# Altium schematic sheet [08] - Microcontroller.SchDoc
size A3
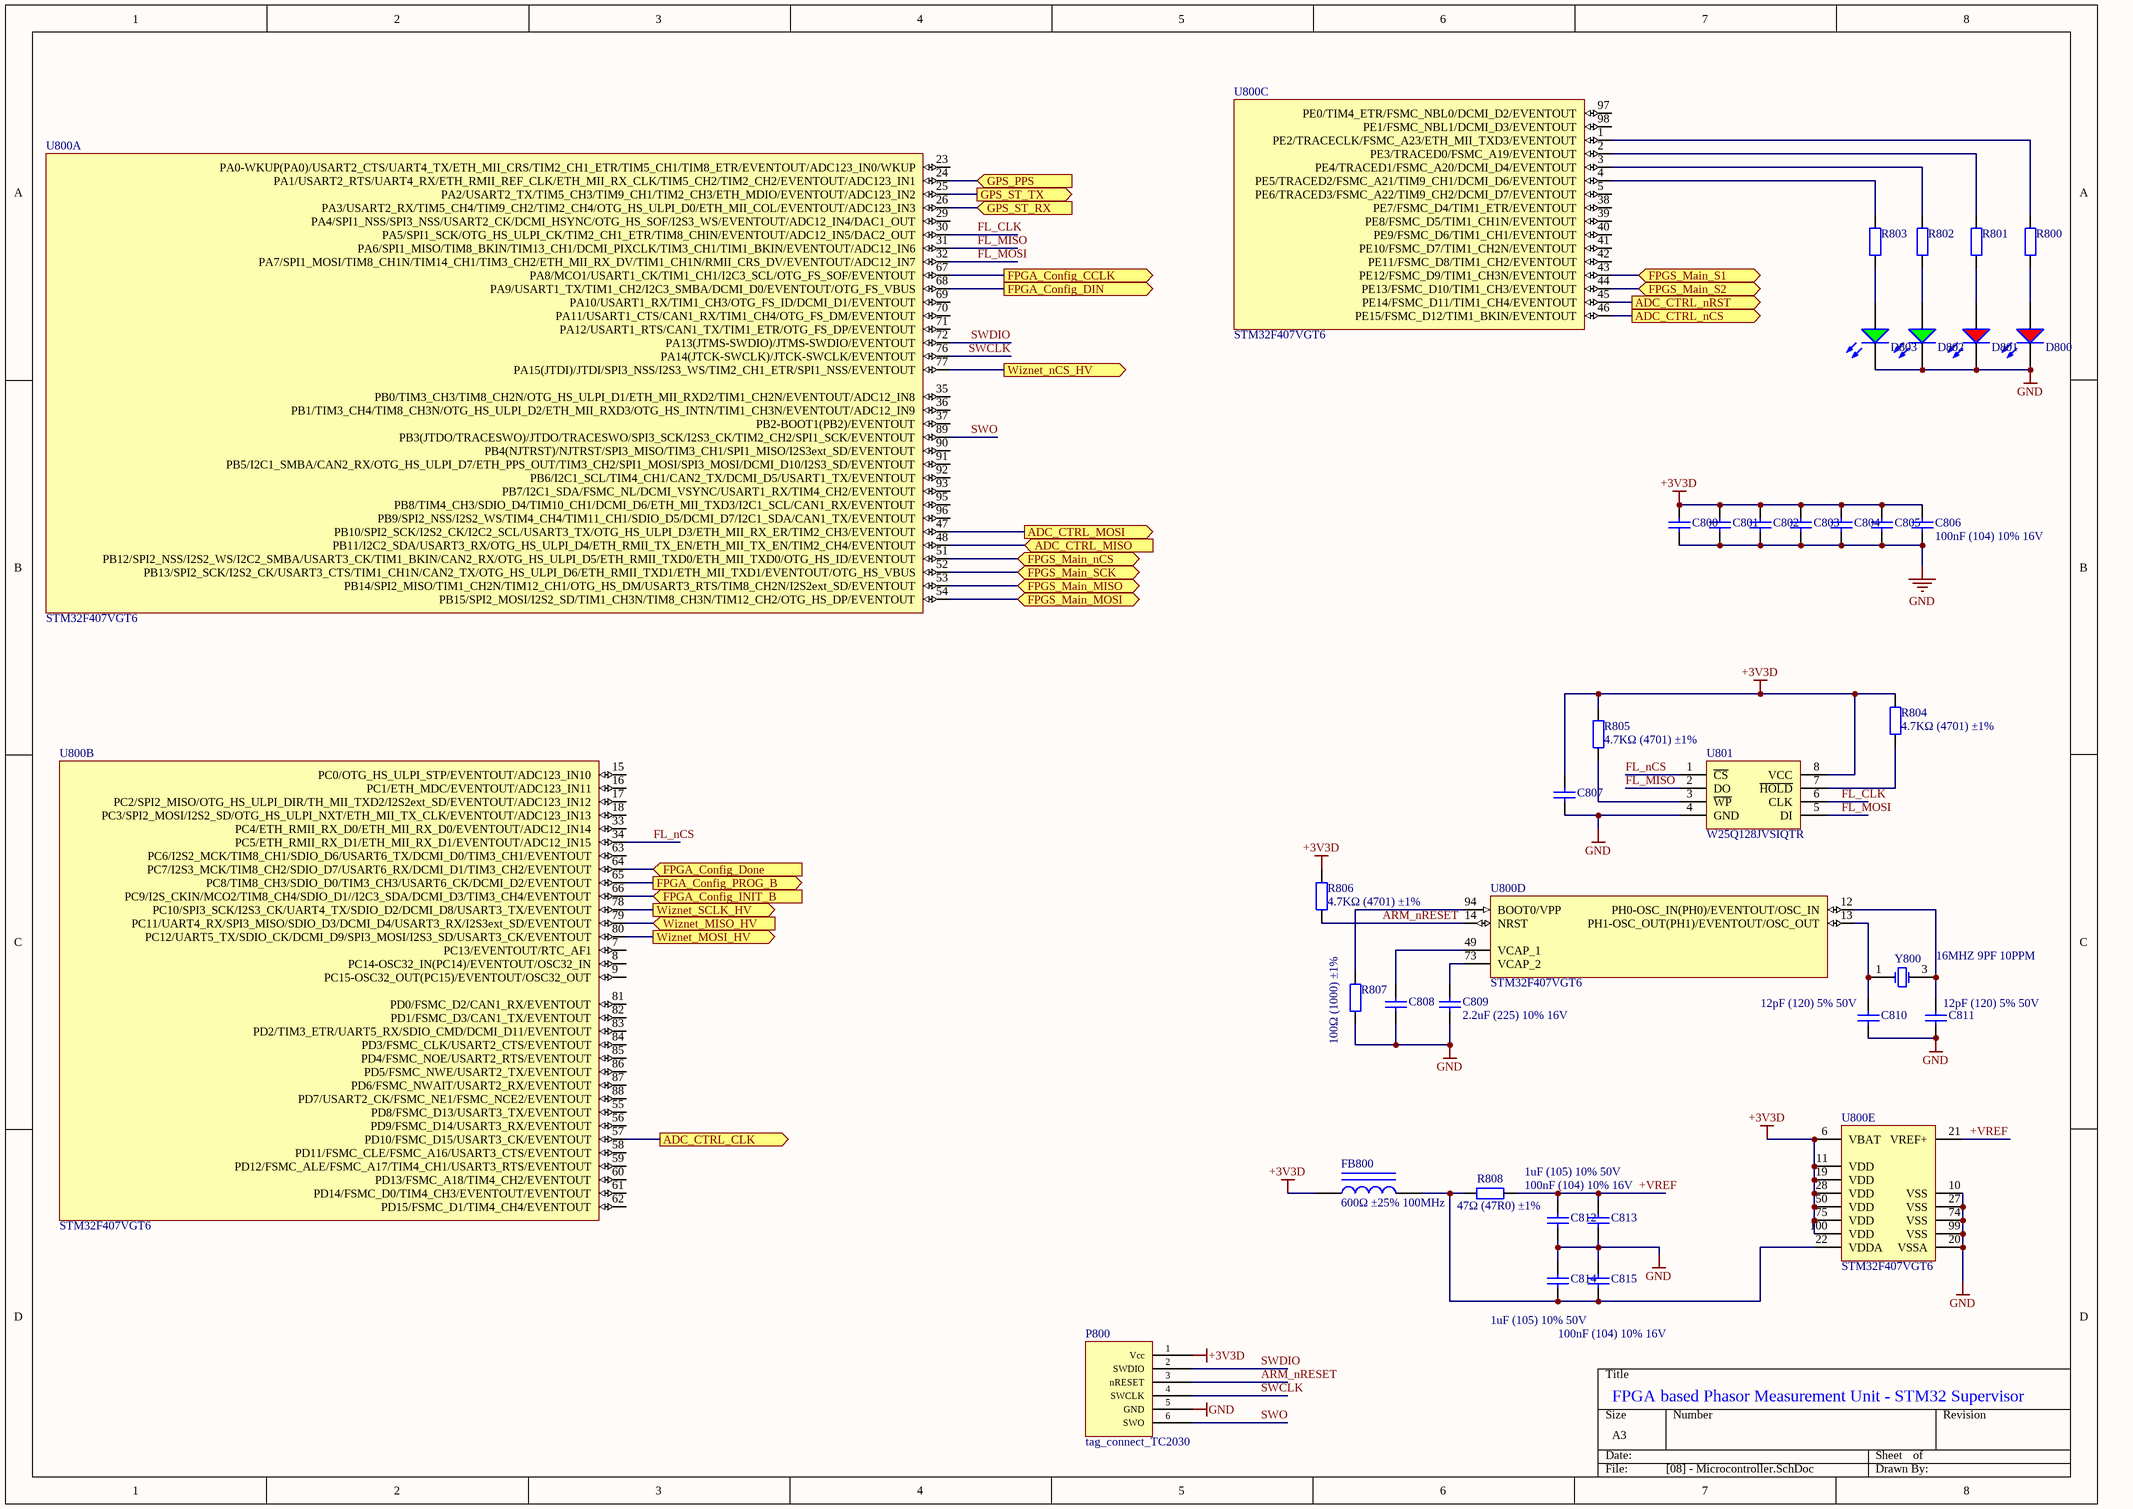
[diagram p0: [08] - Microcontroller.SchDoc]

## Parts
C800  100nF (104) 10% 16V  [0402_C]  (value not drawn)
C801  100nF (104) 10% 16V  [0402_C]  (value not drawn)
C802  100nF (104) 10% 16V  [0402_C]  (value not drawn)
C803  100nF (104) 10% 16V  [0402_C]  (value not drawn)
C804  100nF (104) 10% 16V  [0402_C]  (value not drawn)
C805  100nF (104) 10% 16V  [0402_C]  (value not drawn)
C806  100nF (104) 10% 16V  [0402_C]
C807  100nF (104) 10% 16V  [0402_C]  (value not drawn)
C808  2.2uF (225) 10% 16V  [0603_C]  (value not drawn)
C809  2.2uF (225) 10% 16V  [0603_C]
C810  12pF (120) 5% 50V  [0402_C]
C811  12pF (120) 5% 50V  [0402_C]
C812  1uF (105) 10% 50V  [0603_C]
C813  100nF (104) 10% 16V  [0402_C]
C814  1uF (105) 10% 50V  [0603_C]
C815  100nF (104) 10% 16V  [0402_C]
D800  红灯 0603  [0603_LED_S1]  (value not drawn)
D801  红灯 0603  [0603_LED_S1]  (value not drawn)
D802  绿灯 0603  [0603_LED_S1]  (value not drawn)
D803  绿灯 0603  [0603_LED_S1]  (value not drawn)
FB800  600Ω ±25% 100MHz  [0805_L]
P800  tag_connect_TC2030  [TC2030-MCP-NL]
R800  150Ω (1500) ±1%  [0402_R]  (value not drawn)
R801  150Ω (1500) ±1%  [0402_R]  (value not drawn)
R802  150Ω (1500) ±1%  [0402_R]  (value not drawn)
R803  150Ω (1500) ±1%  [0402_R]  (value not drawn)
R804  4.7KΩ (4701) ±1%  [0402_R]
R805  4.7KΩ (4701) ±1%  [0402_R]
R806  4.7KΩ (4701) ±1%  [0402_R]
R807  100Ω (1000) ±1%  [0402_R]
R808  47Ω (47R0) ±1%  [0402_R]
U800  STM32F407VGT6  [LQFP-100_14x14x05P]  (parts A,B,C,D,E of 5)
U801  W25Q128JVSIQTR  [SOIC-8_208mil]
Y800  16MHZ 9PF 10PPM  [SMD-3225_4P]

## Ports
ADC_CTRL_CLK (out), ADC_CTRL_MISO (in), ADC_CTRL_MOSI (out), ADC_CTRL_nCS (out), ADC_CTRL_nRST (out), FPGA_Config_CCLK (out), FPGA_Config_DIN (out), FPGA_Config_Done (in), FPGA_Config_INIT_B (in), FPGA_Config_PROG_B (out), FPGS_Main_MISO (bidir), FPGS_Main_MOSI (bidir), FPGS_Main_nCS (bidir), FPGS_Main_S1 (bidir), FPGS_Main_S2 (bidir), FPGS_Main_SCK (bidir), GPS_PPS (in), GPS_ST_RX (in), GPS_ST_TX (out), Wiznet_MISO_HV (in), Wiznet_MOSI_HV (out), Wiznet_nCS_HV (out), Wiznet_SCLK_HV (out)

## Nets
+3V3D: C800.2 C801.2 C802.2 C803.2 C804.2 C805.2 C806.2 C807.2 FB800.1 P800.1(Vcc) R804.2 R805.1 R806.2 U800.6(VBAT) U800.11(VDD) U800.19(VDD) U800.28(VDD) U800.50(VDD) U800.75(VDD) U800.100(VDD) U801.8(VCC)
GND: C800.1 C801.1 C802.1 C803.1 C804.1 C805.1 C806.1 C807.1 C808.1 C809.1 C810.2 C811.2 C812.1 C813.1 C814.2 C815.2 D800.K D801.K D802.K D803.K P800.5(GND) R807.1 U800.10(VSS) U800.20(VSSA) U800.27(VSS) U800.74(VSS) U800.99(VSS) U801.4(GND)
+VREF: C812.2 C813.2 R808.2 U800.21(VREF+)
ADC_CTRL_CLK: U800.57(PD10/FSMC_D15/USART3_CK/EVENTOUT) ; port ADC_CTRL_CLK
ADC_CTRL_MISO: U800.48(PB11/I2C2_SDA/USART3_RX/OTG_HS_ULPI_D4/ETH_RMII_TX_EN/ETH_MII_TX_EN/TIM2_CH4/EVENTOUT) ; port ADC_CTRL_MISO
ADC_CTRL_MOSI: U800.47(PB10/SPI2_SCK/I2S2_CK/I2C2_SCL/USART3_TX/OTG_HS_ULPI_D3/ETH_MII_RX_ER/TIM2_CH3/EVENTOUT) ; port ADC_CTRL_MOSI
ADC_CTRL_nCS: U800.46(PE15/FSMC_D12/TIM1_BKIN/EVENTOUT) ; port ADC_CTRL_nCS
ADC_CTRL_nRST: U800.45(PE14/FSMC_D11/TIM1_CH4/EVENTOUT) ; port ADC_CTRL_nRST
ARM_nRESET: P800.3(nRESET) R806.1 U800.14(NRST)
FL_CLK: U800.30(PA5/SPI1_SCK/OTG_HS_ULPI_CK/TIM2_CH1_ETR/TIM8_CHIN/EVENTOUT/ADC12_IN5/DAC2_OUT) U801.6(CLK)
FL_MISO: U800.31(PA6/SPI1_MISO/TIM8_BKIN/TIM13_CH1/DCMI_PIXCLK/TIM3_CH1/TIM1_BKIN/EVENTOUT/ADC12_IN6) U801.2(DO)
FL_MOSI: U800.32(PA7/SPI1_MOSI/TIM8_CH1N/TIM14_CH1/TIM3_CH2/ETH_MII_RX_DV/TIM1_CH1N/RMII_CRS_DV/EVENTOUT/ADC12_IN7) U801.5(DI)
FL_nCS: U800.34(PC5/ETH_RMII_RX_D1/ETH_MII_RX_D1/EVENTOUT/ADC12_IN15) U801.1(~{CS})
FPGA_Config_CCLK: U800.67(PA8/MCO1/USART1_CK/TIM1_CH1/I2C3_SCL/OTG_FS_SOF/EVENTOUT) ; port FPGA_Config_CCLK
FPGA_Config_DIN: U800.68(PA9/USART1_TX/TIM1_CH2/I2C3_SMBA/DCMI_D0/EVENTOUT/OTG_FS_VBUS) ; port FPGA_Config_DIN
FPGA_Config_Done: U800.64(PC7/I2S3_MCK/TIM8_CH2/SDIO_D7/USART6_RX/DCMI_D1/TIM3_CH2/EVENTOUT) ; port FPGA_Config_Done
FPGA_Config_INIT_B: U800.66(PC9/I2S_CKIN/MCO2/TIM8_CH4/SDIO_D1//I2C3_SDA/DCMI_D3/TIM3_CH4/EVENTOUT) ; port FPGA_Config_INIT_B
FPGA_Config_PROG_B: U800.65(PC8/TIM8_CH3/SDIO_D0/TIM3_CH3/USART6_CK/DCMI_D2/EVENTOUT) ; port FPGA_Config_PROG_B
FPGS_Main_MISO: U800.53(PB14/SPI2_MISO/TIM1_CH2N/TIM12_CH1/OTG_HS_DM/USART3_RTS/TIM8_CH2N/I2S2ext_SD/EVENTOUT) ; port FPGS_Main_MISO
FPGS_Main_MOSI: U800.54(PB15/SPI2_MOSI/I2S2_SD/TIM1_CH3N/TIM8_CH3N/TIM12_CH2/OTG_HS_DP/EVENTOUT) ; port FPGS_Main_MOSI
FPGS_Main_nCS: U800.51(PB12/SPI2_NSS/I2S2_WS/I2C2_SMBA/USART3_CK/TIM1_BKIN/CAN2_RX/OTG_HS_ULPI_D5/ETH_RMII_TXD0/ETH_MII_TXD0/OTG_HS_ID/EVENTOUT) ; port FPGS_Main_nCS
FPGS_Main_S1: U800.43(PE12/FSMC_D9/TIM1_CH3N/EVENTOUT) ; port FPGS_Main_S1
FPGS_Main_S2: U800.44(PE13/FSMC_D10/TIM1_CH3/EVENTOUT) ; port FPGS_Main_S2
FPGS_Main_SCK: U800.52(PB13/SPI2_SCK/I2S2_CK/USART3_CTS/TIM1_CH1N/CAN2_TX/OTG_HS_ULPI_D6/ETH_RMII_TXD1/ETH_MII_TXD1/EVENTOUT/OTG_HS_VBUS) ; port FPGS_Main_SCK
GPS_PPS: U800.24(PA1/USART2_RTS/UART4_RX/ETH_RMII_REF_CLK/ETH_MII_RX_CLK/TIM5_CH2/TIM2_CH2/EVENTOUT/ADC123_IN1) ; port GPS_PPS
GPS_ST_RX: U800.26(PA3/USART2_RX/TIM5_CH4/TIM9_CH2/TIM2_CH4/OTG_HS_ULPI_D0/ETH_MII_COL/EVENTOUT/ADC123_IN3) ; port GPS_ST_RX
GPS_ST_TX: U800.25(PA2/USART2_TX/TIM5_CH3/TIM9_CH1/TIM2_CH3/ETH_MDIO/EVENTOUT/ADC123_IN2) ; port GPS_ST_TX
SWCLK: P800.4(SWCLK) U800.76(PA14(JTCK-SWCLK)/JTCK-SWCLK/EVENTOUT)
SWDIO: P800.2(SWDIO) U800.72(PA13(JTMS-SWDIO)/JTMS-SWDIO/EVENTOUT)
SWO: P800.6(SWO) U800.89(PB3(JTDO/TRACESWO)/JTDO/TRACESWO/SPI3_SCK/I2S3_CK/TIM2_CH2/SPI1_SCK/EVENTOUT)
Wiznet_MISO_HV: U800.79(PC11/UART4_RX/SPI3_MISO/SDIO_D3/DCMI_D4/USART3_RX/I2S3ext_SD/EVENTOUT) ; port Wiznet_MISO_HV
Wiznet_MOSI_HV: U800.80(PC12/UART5_TX/SDIO_CK/DCMI_D9/SPI3_MOSI/I2S3_SD/USART3_CK/EVENTOUT) ; port Wiznet_MOSI_HV
Wiznet_nCS_HV: U800.77(PA15(JTDI)/JTDI/SPI3_NSS/I2S3_WS/TIM2_CH1_ETR/SPI1_NSS/EVENTOUT) ; port Wiznet_nCS_HV
Wiznet_SCLK_HV: U800.78(PC10/SPI3_SCK/I2S3_CK/UART4_TX/SDIO_D2/DCMI_D8/USART3_TX/EVENTOUT) ; port Wiznet_SCLK_HV
NetC808_2: C808.2 U800.49(VCAP_1)
NetC809_2: C809.2 U800.73(VCAP_2)
NetC810_1: C810.1 U800.13(PH1-OSC_OUT(PH1)/EVENTOUT/OSC_OUT) Y800.1(OSC1)
NetC811_1: C811.1 U800.12(PH0-OSC_IN(PH0)/EVENTOUT/OSC_IN) Y800.3(OSC2)
NetC814_1: C814.1 C815.1 FB800.2 R808.1 U800.22(VDDA)
NetD800_A: D800.A R800.1
NetD801_A: D801.A R801.1
NetD802_A: D802.A R802.1
NetD803_A: D803.A R803.1
NetR800_2: R800.2 U800.1(PE2/TRACECLK/FSMC_A23/ETH_MII_TXD3/EVENTOUT)
NetR801_2: R801.2 U800.2(PE3/TRACED0/FSMC_A19/EVENTOUT)
NetR802_2: R802.2 U800.3(PE4/TRACED1/FSMC_A20/DCMI_D4/EVENTOUT)
NetR803_2: R803.2 U800.4(PE5/TRACED2/FSMC_A21/TIM9_CH1/DCMI_D6/EVENTOUT)
NetR804_1: R804.1 U801.7(~{HOLD})
NetR805_2: R805.2 U801.3(~{WP})
NetR807_2: R807.2 U800.94(BOOT0/VPP)

Not connected (* = marked no-connect by the designer): U800 5(PE6/TRACED3/FSMC_A22/TIM9_CH2/DCMI_D7/EVENTOUT) 7(PC13/EVENTOUT/RTC_AF1) 8(PC14-OSC32_IN(PC14)/EVENTOUT/OSC32_IN) 9(PC15-OSC32_OUT(PC15)/EVENTOUT/OSC32_OUT) 15(PC0/OTG_HS_ULPI_STP/EVENTOUT/ADC123_IN10) 16(PC1/ETH_MDC/EVENTOUT/ADC123_IN11) 17(PC2/SPI2_MISO/OTG_HS_ULPI_DIR/TH_MII_TXD2/I2S2ext_SD/EVENTOUT/ADC123_IN12) 18(PC3/SPI2_MOSI/I2S2_SD/OTG_HS_ULPI_NXT/ETH_MII_TX_CLK/EVENTOUT/ADC123_IN13) 23(PA0-WKUP(PA0)/USART2_CTS/UART4_TX/ETH_MII_CRS/TIM2_CH1_ETR/TIM5_CH1/TIM8_ETR/EVENTOUT/ADC123_IN0/WKUP) 29(PA4/SPI1_NSS/SPI3_NSS/USART2_CK/DCMI_HSYNC/OTG_HS_SOF/I2S3_WS/EVENTOUT/ADC12_IN4/DAC1_OUT) 33(PC4/ETH_RMII_RX_D0/ETH_MII_RX_D0/EVENTOUT/ADC12_IN14) 35(PB0/TIM3_CH3/TIM8_CH2N/OTG_HS_ULPI_D1/ETH_MII_RXD2/TIM1_CH2N/EVENTOUT/ADC12_IN8) 36(PB1/TIM3_CH4/TIM8_CH3N/OTG_HS_ULPI_D2/ETH_MII_RXD3/OTG_HS_INTN/TIM1_CH3N/EVENTOUT/ADC12_IN9) 37(PB2-BOOT1(PB2)/EVENTOUT) 38(PE7/FSMC_D4/TIM1_ETR/EVENTOUT) 39(PE8/FSMC_D5/TIM1_CH1N/EVENTOUT) 40(PE9/FSMC_D6/TIM1_CH1/EVENTOUT) 41(PE10/FSMC_D7/TIM1_CH2N/EVENTOUT) 42(PE11/FSMC_D8/TIM1_CH2/EVENTOUT) 55(PD8/FSMC_D13/USART3_TX/EVENTOUT) 56(PD9/FSMC_D14/USART3_RX/EVENTOUT) 58(PD11/FSMC_CLE/FSMC_A16/USART3_CTS/EVENTOUT) 59(PD12/FSMC_ALE/FSMC_A17/TIM4_CH1/USART3_RTS/EVENTOUT) 60(PD13/FSMC_A18/TIM4_CH2/EVENTOUT) 61(PD14/FSMC_D0/TIM4_CH3/EVENTOUT/EVENTOUT) 62(PD15/FSMC_D1/TIM4_CH4/EVENTOUT) 63(PC6/I2S2_MCK/TIM8_CH1/SDIO_D6/USART6_TX/DCMI_D0/TIM3_CH1/EVENTOUT) 69(PA10/USART1_RX/TIM1_CH3/OTG_FS_ID/DCMI_D1/EVENTOUT) 70(PA11/USART1_CTS/CAN1_RX/TIM1_CH4/OTG_FS_DM/EVENTOUT) 71(PA12/USART1_RTS/CAN1_TX/TIM1_ETR/OTG_FS_DP/EVENTOUT) 81(PD0/FSMC_D2/CAN1_RX/EVENTOUT) 82(PD1/FSMC_D3/CAN1_TX/EVENTOUT) 83(PD2/TIM3_ETR/UART5_RX/SDIO_CMD/DCMI_D11/EVENTOUT) 84(PD3/FSMC_CLK/USART2_CTS/EVENTOUT) 85(PD4/FSMC_NOE/USART2_RTS/EVENTOUT) 86(PD5/FSMC_NWE/USART2_TX/EVENTOUT) 87(PD6/FSMC_NWAIT/USART2_RX/EVENTOUT) 88(PD7/USART2_CK/FSMC_NE1/FSMC_NCE2/EVENTOUT) 90(PB4(NJTRST)/NJTRST/SPI3_MISO/TIM3_CH1/SPI1_MISO/I2S3ext_SD/EVENTOUT) 91(PB5/I2C1_SMBA/CAN2_RX/OTG_HS_ULPI_D7/ETH_PPS_OUT/TIM3_CH2/SPI1_MOSI/SPI3_MOSI/DCMI_D10/I2S3_SD/EVENTOUT) 92(PB6/I2C1_SCL/TIM4_CH1/CAN2_TX/DCMI_D5/USART1_TX/EVENTOUT) 93(PB7/I2C1_SDA/FSMC_NL/DCMI_VSYNC/USART1_RX/TIM4_CH2/EVENTOUT) 95(PB8/TIM4_CH3/SDIO_D4/TIM10_CH1/DCMI_D6/ETH_MII_TXD3/I2C1_SCL/CAN1_RX/EVENTOUT) 96(PB9/SPI2_NSS/I2S2_WS/TIM4_CH4/TIM11_CH1/SDIO_D5/DCMI_D7/I2C1_SDA/CAN1_TX/EVENTOUT) 97(PE0/TIM4_ETR/FSMC_NBL0/DCMI_D2/EVENTOUT) 98(PE1/FSMC_NBL1/DCMI_D3/EVENTOUT)

## Notes on the sheet
- FPGA based Phasor Measurement Unit - STM32 Supervisor

## Library data of the parts
C800-C807 C813 C815 = 0402 100nF (104) 10% 16V: 贴片电容; ComponentLink1Description: 供应商链接; ComponentLink1URL: http://www.szlcsc.com/product/details_1877.html; Package: 0402; Supplier: LC; SuppliersPartNumber: C1525
C808 C809 = 0603 2.2uF (225) 10% 16V: 贴片电容; ComponentLink1Description: 供应商链接; ComponentLink1URL: http://www.szlcsc.com/product/details_24366.html; Package: 0603; Supplier: LC; SuppliersPartNumber: C23630
C810 C811 = 0402 12pF (120) 5% 50V: 贴片电容; ComponentLink1Description: 供应商链接; ComponentLink1URL: http://www.szlcsc.com/product/details_1899.html; Package: 0402; Supplier: LC; SuppliersPartNumber: C1547
C812 C814 = 0603 1uF (105) 10% 50V: 贴片电容; ComponentLink1Description: 供应商链接; ComponentLink1URL: http://www.szlcsc.com/product/details_16531.html; Package: 0603; Supplier: LC; SuppliersPartNumber: C15849
D800 D801 = 0603 红灯: 发光二极管; ComponentLink1Description: 供应商链接; ComponentLink1URL: http://www.szlcsc.com/product/details_2659.html; Package: 0603; Supplier: LC; SuppliersPartNumber: C2286
D802 D803 = 0603 绿灯: 发光二极管; ComponentLink1Description: 供应商链接; ComponentLink1URL: http://www.szlcsc.com/product/details_73152.html; Package: 0603; Supplier: LC; SuppliersPartNumber: C72043
FB800 = 0805 600Ω 25% 100MHz: 贴片磁珠; ComponentLink1Description: 供应商链接; ComponentLink1URL: http://www.szlcsc.com/product/details_1369.html; Package: 0805; Supplier: LC; SuppliersPartNumber: C1017
R800-R803 = 0402 150Ω (1500) 1%: 贴片电阻; ComponentLink1Description: 供应商链接; ComponentLink1URL: http://www.szlcsc.com/product/details_25825.html; Package: 0402; Supplier: LC; SuppliersPartNumber: C25082
R804-R806 = 0402 4.7KΩ (4701) 1%: 贴片电阻; ComponentLink1Description: 供应商链接; ComponentLink1URL: http://www.szlcsc.com/product/details_26643.html; Package: 0402; Supplier: LC; SuppliersPartNumber: C25900
R807 = 0402 100Ω (1000) 1%: 贴片电阻; ComponentLink1Description: 供应商链接; ComponentLink1URL: http://www.szlcsc.com/product/details_25819.html; Package: 0402; Supplier: LC; SuppliersPartNumber: C25076
R808 = 0402 47Ω (47R0) 1%: 贴片电阻; ComponentLink1Description: 供应商链接; ComponentLink1URL: http://www.szlcsc.com/product/details_25861.html; Package: 0402; Supplier: LC; SuppliersPartNumber: C25118
U800 = STM32F407VGT6: ARM; ComponentLink1Description: 供应商链接; ComponentLink1URL: http://www.szlcsc.com/product/details_12968.html; Package: LQFP-100_14x14x05P; Supplier: LC; SuppliersPartNumber: C12345
U801 = W25Q128JVSIQTR_[C97521]: Flash ROM; ComponentLink1Description: 供应商链接; ComponentLink1URL: https://item.szlcsc.com/98729.html; Package: SOIC-8; Supplier: LC; SuppliersPartNumber: C97521
Y800 = SMD-3225_4P  16MHZ 9PF 10PPM: 贴片晶振; ComponentLink1Description: 供应商链接; ComponentLink1URL: http://www.szlcsc.com/product/details_14393.html; Package: SMD-3225_4P; Supplier: LC; SuppliersPartNumber: C13738
P800 = tag_connect_TC2030: JLCPCB: NO